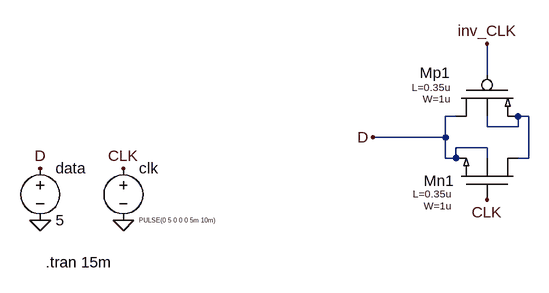
[diagram p0: schematic flop_flop.asc]
flop_flop.asc, the LTspice schematic file:
Version 4.1
SHEET 1 880 680
WIRE 128 80 128 32
WIRE 80 144 64 144
WIRE 192 144 176 144
WIRE 128 160 128 144
WIRE 176 160 176 144
WIRE 176 160 128 160
WIRE 64 176 64 144
WIRE 64 176 -48 176
WIRE 128 192 80 192
WIRE 64 208 64 176
WIRE 80 208 80 192
WIRE 80 208 64 208
WIRE 128 208 128 192
WIRE 192 208 192 144
WIRE 192 208 176 208
FLAG 128 272 CLK
FLAG 128 32 inv_CLK
FLAG -48 176 D
FLAG -560 224 D
FLAG -560 304 0
FLAG -432 304 0
FLAG -432 224 CLK
SYMBOL EE551\\PMOS4 128 80 R90
WINDOW 123 37 56 VRight 1
WINDOW 39 19 57 VRight 1
WINDOW 0 -3 56 VRight 2
SYMATTR InstName Mp1
SYMBOL lib_files\\NMOS4 128 272 M270
WINDOW 123 -9 97 VLeft 1
WINDOW 39 9 114 VLeft 1
WINDOW 0 29 97 VLeft 2
SYMATTR InstName Mn1
SYMBOL voltage -560 208 R0
SYMATTR InstName data
SYMATTR Value 5
SYMBOL voltage -432 208 R0
WINDOW 3 24 96 Left 0
WINDOW 123 0 0 Left 0
WINDOW 39 0 0 Left 0
SYMATTR InstName clk
SYMATTR Value PULSE(0 5 0 0 0 5m 10m)
TEXT -552 368 Left 2 !.tran 15m

The netlist it stands for:
* flop_flop.asc
X§Mp1 D inv_CLK N001 N001 PFET W=1u L=0.35u  ; pins Vd Vg Vs Vw
X§Mn1 N001 CLK D D NFET W=1u L=0.35u  ; pins Vd Vg Vs Vb
V§data D 0 5
V§clk CLK 0 PULSE(0 5 0 0 0 5m 10m)
.tran 15m
.lib ee551.lib
.backanno
.end